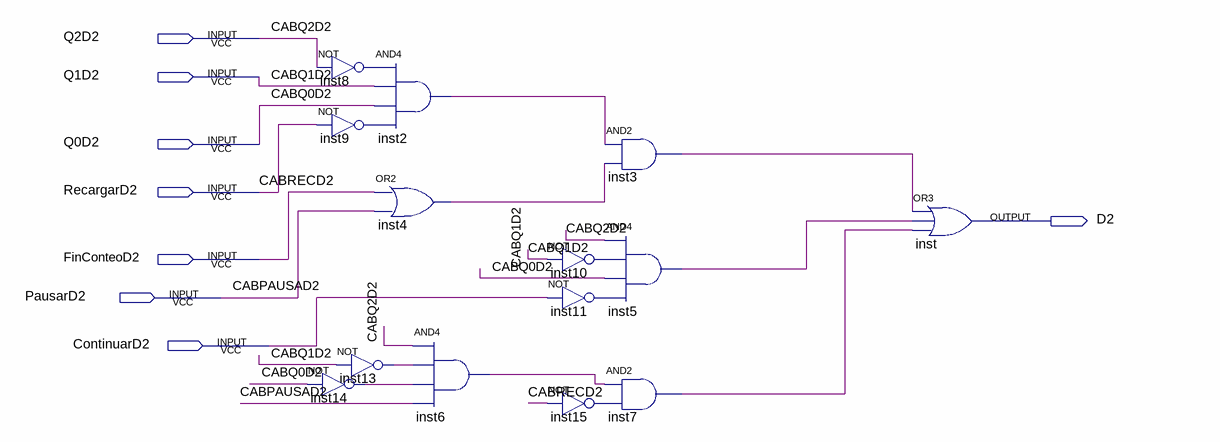
[diagram p0: schematic sheet]
// Quartus schematic ControllerD2.bdf as structural Verilog: 14 symbols, 8 pins
module ControllerD2 (
  input  Q2D2,
  input  Q1D2,
  input  Q0D2,
  input  RecargarD2,
  input  FinConteoD2,
  input  PausarD2,
  input  ContinuarD2,
  output D2
);

  wire inst2_out, inst3_out, inst4_out, inst5_out, inst6_out, inst7_out, inst8_out, inst9_out, inst10_out,
       inst11_out, inst13_out, inst14_out, inst15_out;

  not inst8 (inst8_out, Q2D2);
  not inst9 (inst9_out, RecargarD2);
  not inst13 (inst13_out, Q1D2);
  not inst14 (inst14_out, Q0D2);
  and inst2 (inst2_out, inst8_out, Q1D2, Q0D2, inst9_out);
  or inst4 (inst4_out, FinConteoD2, PausarD2);
  and inst6 (inst6_out, Q2D2, inst13_out, inst14_out, PausarD2);
  not inst10 (inst10_out, Q1D2);
  not inst11 (inst11_out, ContinuarD2);
  not inst15 (inst15_out, RecargarD2);
  and inst3 (inst3_out, inst2_out, inst4_out);
  and inst5 (inst5_out, Q2D2, inst10_out, Q0D2, inst11_out);
  and inst7 (inst7_out, inst6_out, inst15_out);
  or inst (D2, inst3_out, inst5_out, inst7_out);

  // Other names for the same wires on the sheet: CABPAUSAD2 = PausarD2; CABQ2D2 = Q2D2; CABRECD2 = RecargarD2;
  //   CABQ0D2 = Q0D2; CABQ1D2 = Q1D2
endmodule
